# Altium schematic sheet ACD_FTP01_Harness.SchDoc
size Letter; DocumentNumber: ACD_FTP01_Harness; SheetNumber: 1; SheetTotal: 1
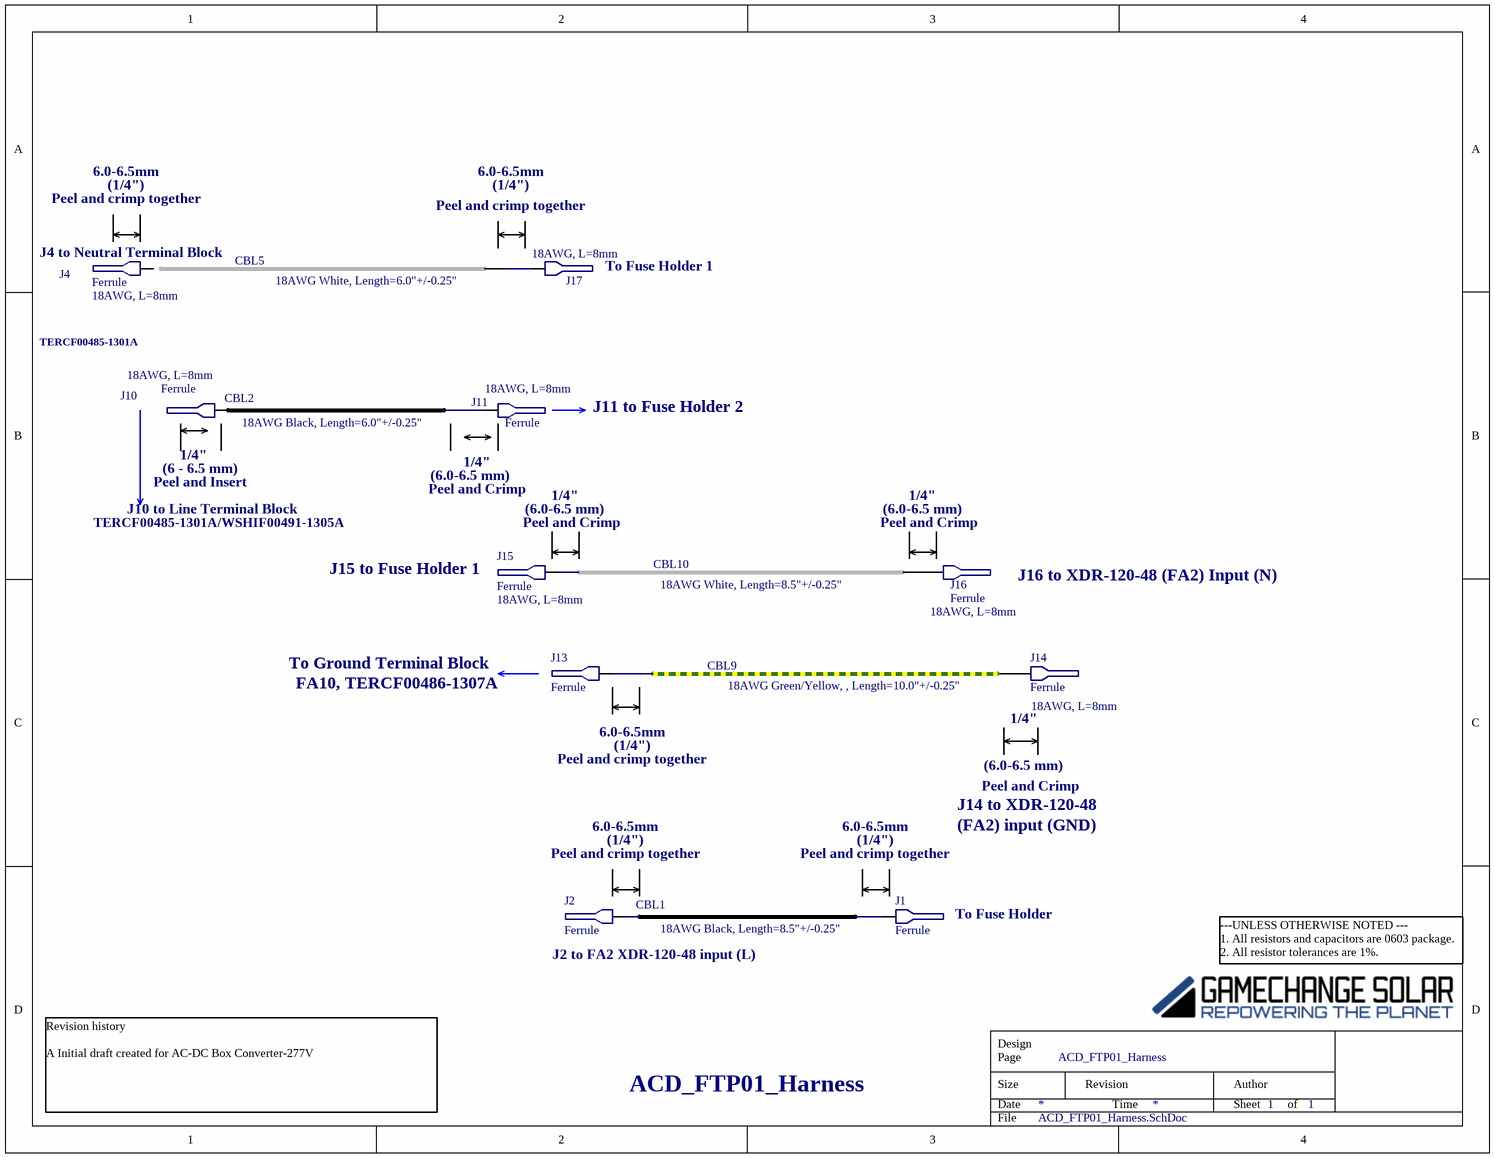
[diagram p0: ACD_FTP01_Harness.SchDoc]

## Parts
CBL1  18AWG Black, Length=8.5"+/-0.25"  (mechanical)
CBL2  18AWG Black, Length=6.0"+/-0.25"  (mechanical)
CBL5  18AWG White, Length=6.0"+/-0.25"  (mechanical)
CBL9  18AWG Green/Yellow, , Length=10.0"+/-0.25"  (mechanical)
CBL10  18AWG White, Length=8.5"+/-0.25"  (mechanical)
J1  Ferrule
J2  Ferrule
J4  Ferrule  Package: 18AWG, L=8mm
J10  Ferrule  Package: 18AWG, L=8mm
J11  Ferrule  Package: 18AWG, L=8mm
J13  Ferrule
J14  Ferrule  Package: 18AWG, L=8mm
J15  Ferrule  Package: 18AWG, L=8mm
J16  Ferrule  Package: 18AWG, L=8mm
J17  Package: 18AWG, L=8mm  (hidden comment: Ferrule)

## Nets

Not connected (* = marked no-connect by the designer): J1 1(X); J2 1(X); J4 1(X); J10 1(X); J11 1(X); J13 1(X); J14 1(X); J15 1(X); J16 1(X); J17 1(X)

## Notes on the sheet
- 6.0-6.5mm
- Peel and crimp together
- (1/4")
- (near J4) J4 to Neutral Terminal Block
- To Fuse Holder 1
- TERCF00485-1301A
- J11 to Fuse Holder 2
- (near J10) 1/4"
- Peel and Insert
- (near J10) (6 - 6.5 mm)
- (6.0-6.5 mm)
- Peel and Crimp
- (near J11) 1/4"
- 1/4"
- TERCF00485-1301A/WSHIF00491-1305A
- J10 to Line Terminal Block
- (near J15) Peel and Crimp
- (near J16) Peel and Crimp
- (near J15) J15 to Fuse Holder 1
- J16 to XDR-120-48 (FA2) Input (N)
- To Ground Terminal Block
- FA10, TERCF00486-1307A
- (near J13) 6.0-6.5mm
- (near J14) 1/4"
- J14 to XDR-120-48
- (FA2) input (GND)
- J2 to FA2 XDR-120-48 input (L)
- To Fuse Holder
- Revision history
  A Initial draft created for AC-DC Box Converter-277V
- ---UNLESS OTHERWISE NOTED ---
  1. All resistors and capacitors are 0603 package.
  2. All resistor tolerances are 1%.
- Design
- Size
- Date
- Page
- Revision
- Time
- Sheet
- Author
- of
- File

## Library data of the parts
CBL1 CBL2 = CBL,BLACK,18AWG: Hook-Up Wire, UL 1569, 18 AWG, Black; MFR1: Alpha Wire; MPN1: 891819 BK005; GCS PN: WIRHF00346-BK00A; Quantity: 1; MFR2: Open Source; MPN2: Open Source
CBL5 CBL10 = CBL,WHITE,18AWG: Hook-Up Wire, UL 1569, 18 AWG, White; MFR1: Alpha Wire; MPN1: 891819 WH005; GCS PN: WIRHF00347-WH00A; Quantity: 1; MFR2: Open Source; MPN2: Open Source
CBL9 = CBL,GREEN/YELLOW,18AWG: Hook-Up Wire, UL 1569, 18 AWG, Green, Yellow Stripe; MFR1: Alpha Wire; MPN1: 3055 GY005; GCS PN: WIRHF00439-GRYLA; Quantity: 1; MFR2: Open Source; MPN2: Open Source
J1 J2 J4 J10 J11 J14-J17 = HDR,1X1,Ferrule,Red: Red Wire Ferrule Connector 18 AWG Single Wire; MFR1: Phoenix Contact; MPN1: 3200904; Alternative source: free of choice; GCS PN: TERFF00379-1800A
  J1 J2: Package: 18AWG, L=8mm
J13 = HDR,1X1,Ferrule,Gray: Gray Wire Ferrule Connector 12 AWG Single Wire; MFR1: Phoenix Contact; MPN1: 3200535; Alternative source: free of choice; GCS PN: TERFF00383-1200A; Package: 12AWG, L=10mm